# Altium schematic sheet [20] - ETHERNET, SATA.SchDoc
size A3; DocumentNumber: 20; SheetNumber: 20; SheetTotal: 31
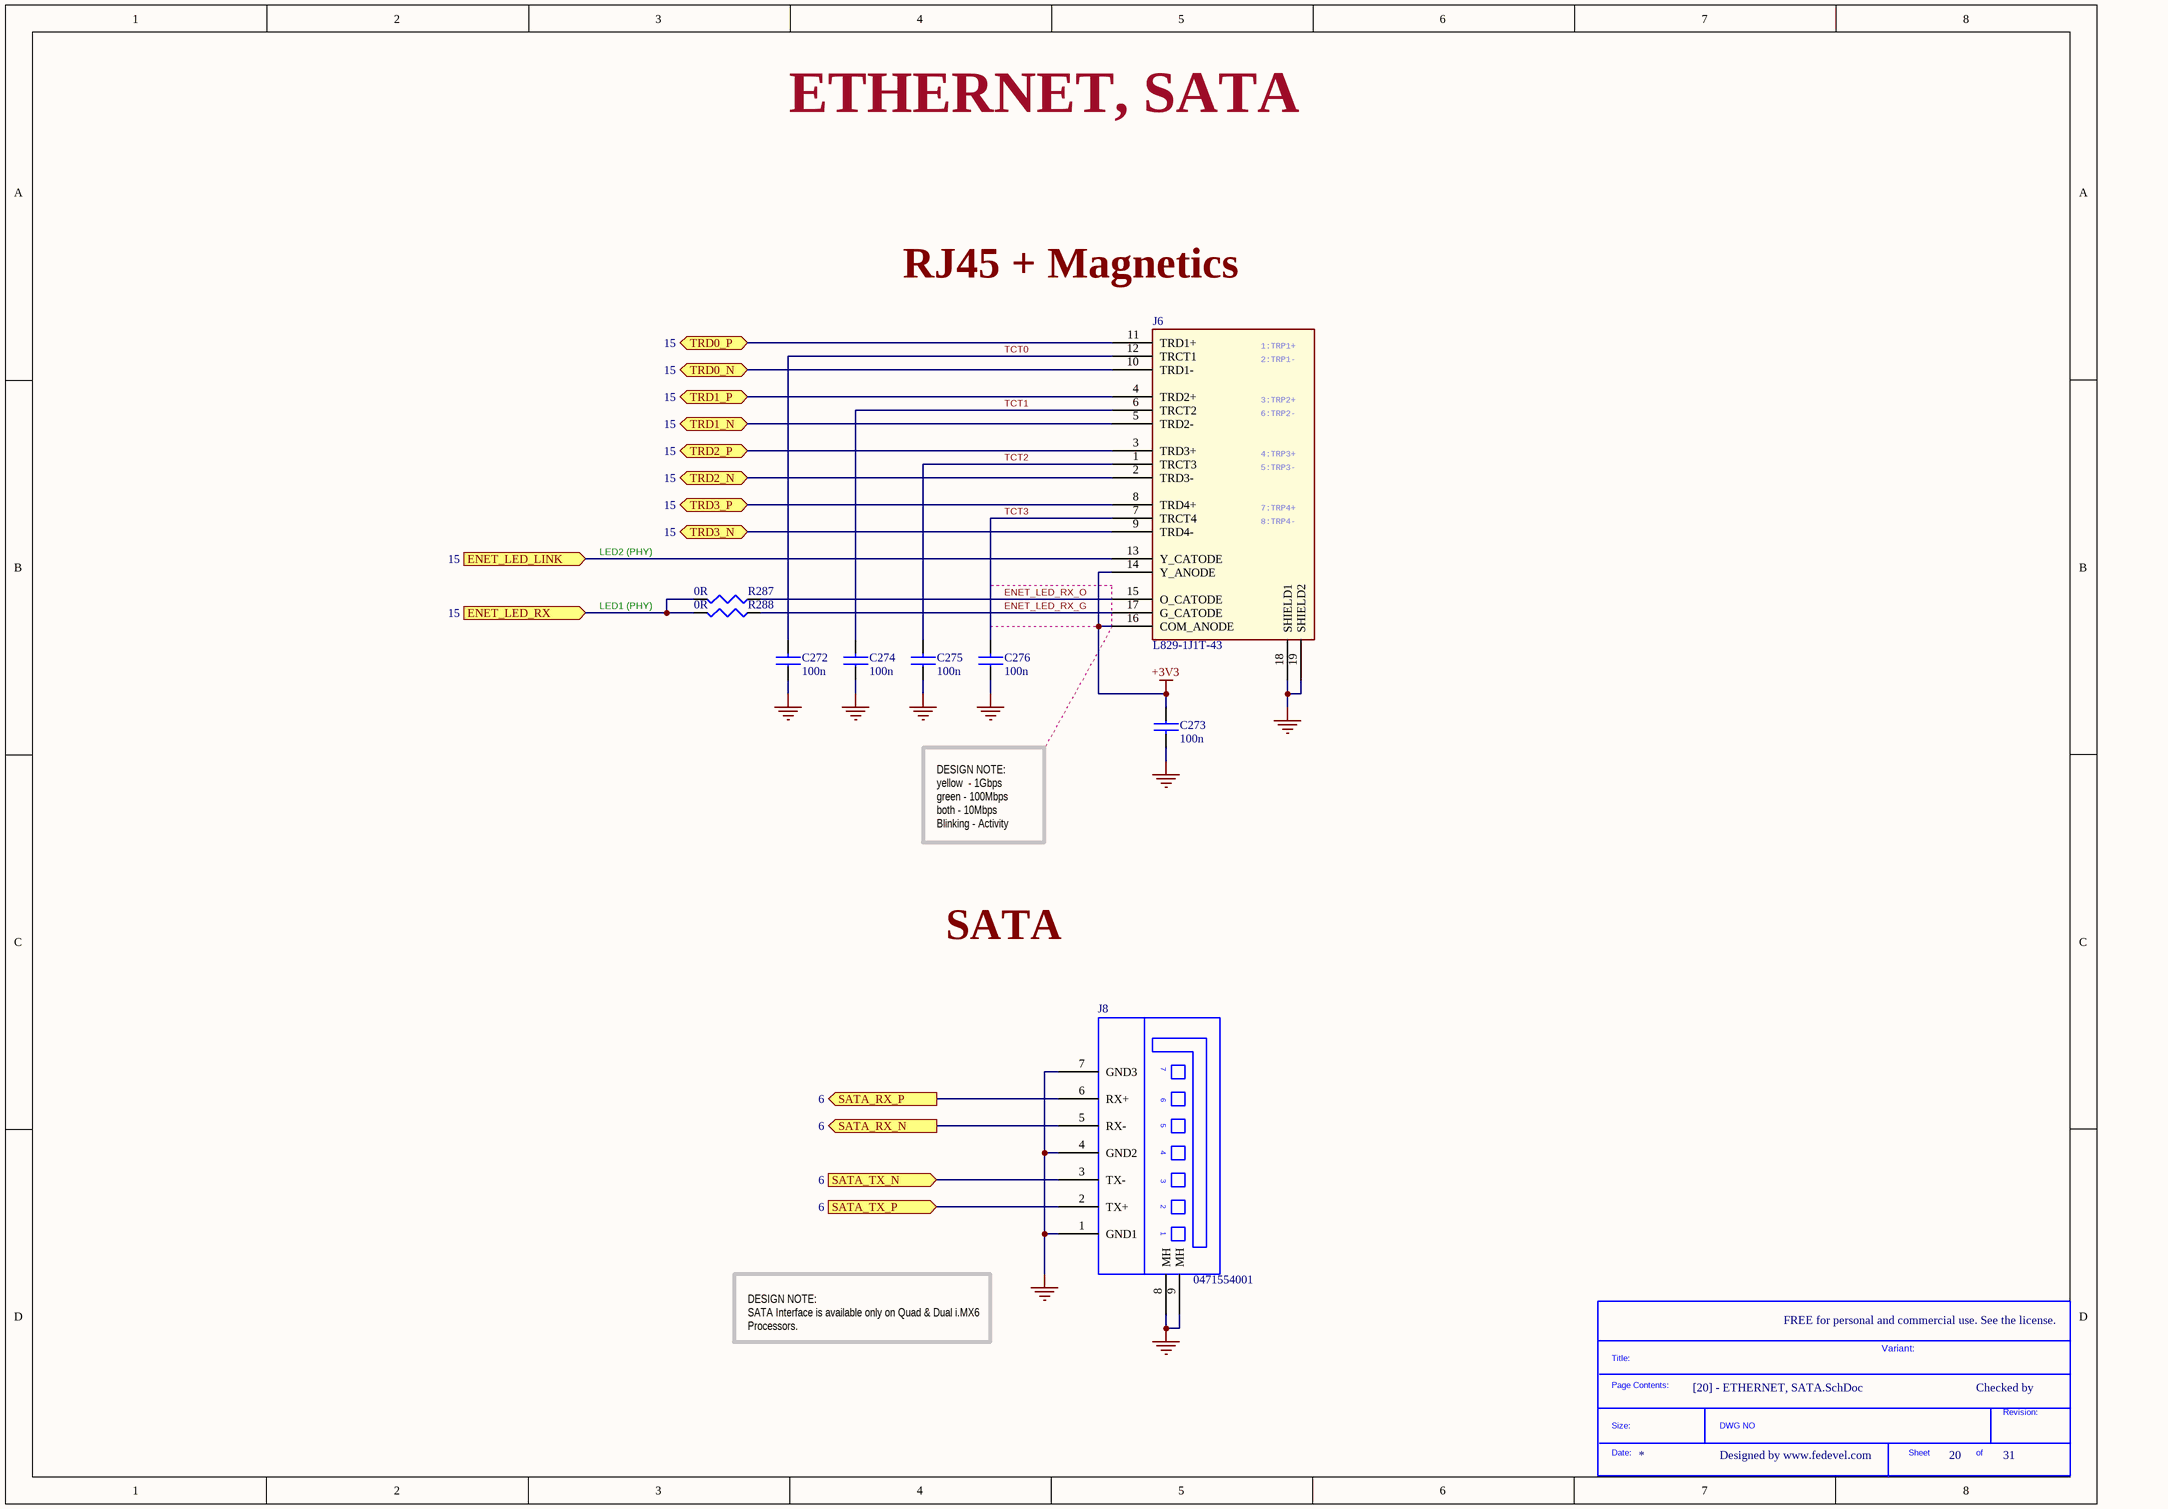
[diagram p0: [20] - ETHERNET, SATA.SchDoc]

## Parts
*  SDTitleBlock  (value not drawn)  (graphical)
C272  100n  [C0402]
C273  100n  [C0402]
C274  100n  [C0402]
C275  100n  [C0402]
C276  100n  [C0402]
J6  L829-1J1T-43  [L829-1J1T-43]
J8  0471554001  [SATA_VERTICAL]
R287  0R  [R0402]
R288  0R  [R0402]

## Ports
ENET_LED_LINK (in, see 15), ENET_LED_RX (in, see 15), SATA_RX_N (out, see 6), SATA_RX_P (out, see 6), SATA_TX_N (in, see 6), SATA_TX_P (in, see 6), TRD0_N (bidir, see 15), TRD0_P (bidir, see 15), TRD1_N (bidir, see 15), TRD1_P (bidir, see 15), TRD2_N (bidir, see 15), TRD2_P (bidir, see 15), TRD3_N (bidir, see 15), TRD3_P (bidir, see 15)

## Nets
+3V3: C273.1 J6.14(Y_ANODE) J6.16(COM_ANODE)
GND: C272.1 C273.2 C274.1 C275.1 C276.1 J6.18(SHIELD1) J6.19(SHIELD2) J8.1(GND1) J8.4(GND2) J8.7(GND3) J8.8(MH) J8.9(MH)
ENET_LED_LINK: J6.13(Y_CATODE) ; port ENET_LED_LINK
ENET_LED_RX: R287.2 R288.2 ; port ENET_LED_RX
ENET_LED_RX_G: J6.17(G_CATODE) R288.1
ENET_LED_RX_O: J6.15(O_CATODE) R287.1
SATA_RX_N: J8.5(RX-) ; port SATA_RX_N
SATA_RX_P: J8.6(RX+) ; port SATA_RX_P
SATA_TX_N: J8.3(TX-) ; port SATA_TX_N
SATA_TX_P: J8.2(TX+) ; port SATA_TX_P
TCT0: C272.2 J6.12(TRCT1)
TCT1: C274.2 J6.6(TRCT2)
TCT2: C275.2 J6.1(TRCT3)
TCT3: C276.2 J6.7(TRCT4)
TRD0_N: J6.10(TRD1-) ; port TRD0_N
TRD0_P: J6.11(TRD1+) ; port TRD0_P
TRD1_N: J6.5(TRD2-) ; port TRD1_N
TRD1_P: J6.4(TRD2+) ; port TRD1_P
TRD2_N: J6.2(TRD3-) ; port TRD2_N
TRD2_P: J6.3(TRD3+) ; port TRD2_P
TRD3_N: J6.9(TRD4-) ; port TRD3_N
TRD3_P: J6.8(TRD4+) ; port TRD3_P

## Notes on the sheet
- ETHERNET, SATA
- RJ45 + Magnetics
- LED2 (PHY)
- LED1 (PHY)
- DESIGN NOTE:
  yellow  - 1Gbps
  green - 100Mbps
  both - 10Mbps
  Blinking - Activity
- SATA
- FREE for personal and commercial use. See the license.
- DESIGN NOTE:
  SATA Interface is available only on Quad & Dual i.MX6 Processors.
- Variant:
- Checked by
- Designed by www.fedevel.com
- (in symbol L829-1J1T-43) 1:TRP1+; 2:TRP1-; 3:TRP2+; 6:TRP2-; 4:TRP3+; 5:TRP3-; 7:TRP4+; 8:TRP4-
- (in symbol SDTitleBlock) Title:; Page Contents:; Revision:; Size:; DWG NO; Date:; Sheet; of

## Library data of the parts
C272-C276 = C1005X5R1H104K: CAP CER .10UF 50V X5R 10% 0402; Manufacturer: TDK Corporation; Capacitance: 0.1µF; Value: 100nF; .Checked PCB: used; Category: Capacitors; Supplier Part Number: 445-5942-1-ND; Manufacturer Part Number: C1005X5R1H104K; Operating Temperature: -55°C ~ 85°C; Package / Case: 0402 (1005 Metric); Price 1k [$]: 0.02340; .Checked SCH: used; Voltage - Rated: 50V; Supplier: Digikey; Supplier 1: Digi-Key; Supplier Part Number 1: 445-5942-1-ND; RoHS: RoHS Compliant; Stock 1: 106926; Pricing 1: 1=0.27, 10=0.18, 100=0.072, 250=0.05176, 500=0.0369, 1000=0.027 (USD); Tolerance: ±10%; Temperature Coefficient: X5R; Mounting Type: Surface Mount, MLCC; Applications: General Purpose; Ratings: -; Size / Dimension: 0.039" L x 0.020" W (1.00mm x 0.50mm); Height - Seated (Max): -; Thickness (Max): 0.022" (0.55mm); Lead Spacing: -; Features: -; Packaging: Cut Tape (CT); Lead Style: -; ComponentLink1URL: http://www.tdk.co.jp/tefe02/e412_c.pdf; ComponentLink1Description: http://www.tdk.co.jp/tefe02/e412_c.pdf
J6 = L829-1J1T-43: CONN MAGJACK 1PORT SHLD 1000BT; Manufacturer: Bel Fuse Inc; Connector Type: RJ45; Number of Ports: 1; Speed: 10/100/1000 Base-T; LED Color: Green, Orange - Yellow; Number of Cores per Jack: 8; Shielding: Shielded; Tab Direction: Up; .Checked PCB: RF; Supplier 1: Digi-Key; Manufacturer Part Number: L829-1J1T-43; RoHS: RoHS Compliant; Category: Connectors, Interconnects; Stock 1: 7172; Pricing 1: 1=4.67, 10=3.863, 100=2.8974, 250=2.672, 500=2.41446, 1000=2.14082, 2500=2.05229, 5000=2.01205 (GBP); Number of Rows: 1; Mounting Type: Panel Mount; Through Hole, Right Angle; Height Above Board: 0.445" (11.30mm); Features: AutoMDIX, Board Guide; Packaging: Tray; ComponentLink1URL: http://www.belfuse.com/Data/Datasheets/L829-1J1T-43.pdf; ComponentLink1Description: http://www.belfuse.com/Data/Datasheets/L829-1J1T-43.pdf; Supplier Part Number 1: 380-1110-ND; .Checked SCH: RF
J8 = 0471554001: CONN SATA HDR 7POS PCB VERT; Manufacturer: Molex Inc; Connector Style: Header, Shrouded; Number of Positions: 7; .Checked PCB: used; Supplier 1: Digi-Key; Supplier Part Number 1: WM4059-ND; Manufacturer Part Number: 0471554001; RoHS: RoHS Compliant; Category: Connectors, Interconnects; Stock 1: 8065; Pricing 1: 1=1.37, 10=1.065, 25=0.9928, 50=0.9026, 100=0.8123, 250=0.68592, 500=0.6498, 1000=0.5776, 2500=0.48013 (USD); Connector Type: SATA; Mounting Type: Through Hole; Termination: Solder; Features: Board Lock; Contact Finish: Gold; Contact Finish Thickness: Flash; Packaging: Tray; ComponentLink1URL: http://www.molex.com/elqNow/elqRedir.htm?ref=http://www.molex.com/pdm_docs/sd/471554001_sd.pdf; ComponentLink1Description: http://www.molex.com/elqNow/elqRedir.htm?ref=http://www.molex.com/pdm_docs/sd/471554001_sd.pdf; .Checked SCH: used
R287 R288 = RC0402JR-070RL: RES 0.0 OHM 1/16W 0402 SMD; Manufacturer: Yageo; Resistance (Ohms): 0.0; Power (Watts): 0.063W, 1/16W; Tolerance: Jumper; .Checked PCB: used; Category: Resistors; Supplier Part Number: 311-0.0JRCT-ND; Manufacturer Part Number: RC0402JR-070RL; Package / Case: 0402 (1005 Metric); Price 1k [$]: 0.01389; Value: 0R; .Checked SCH: used; Supplier: Digikey; Supplier 1: Digi-Key; Supplier Part Number 1: 311-0.0JRCT-ND; RoHS: RoHS Compliant; Stock 1: 1106330; Pricing 1: 10=0.012, 50=0.009, 100=0.0069, 250=0.00512, 500=0.0038, 1000=0.00253 (USD); Composition: Thick Film; Features: -; Temperature Coefficient: -; Size / Dimension: 0.039" L x 0.020" W (1.00mm x 0.50mm); Height: 0.016" (0.40mm); Number of Terminations: 2; Packaging: Cut Tape (CT); ComponentLink1URL: http://www.yageo.com/documents/recent/PYu-RC0402_51_RoHS_L_6.pdf; ComponentLink1Description: http://www.yageo.com/documents/recent/PYu-RC0402_51_RoHS_L_6.pdf